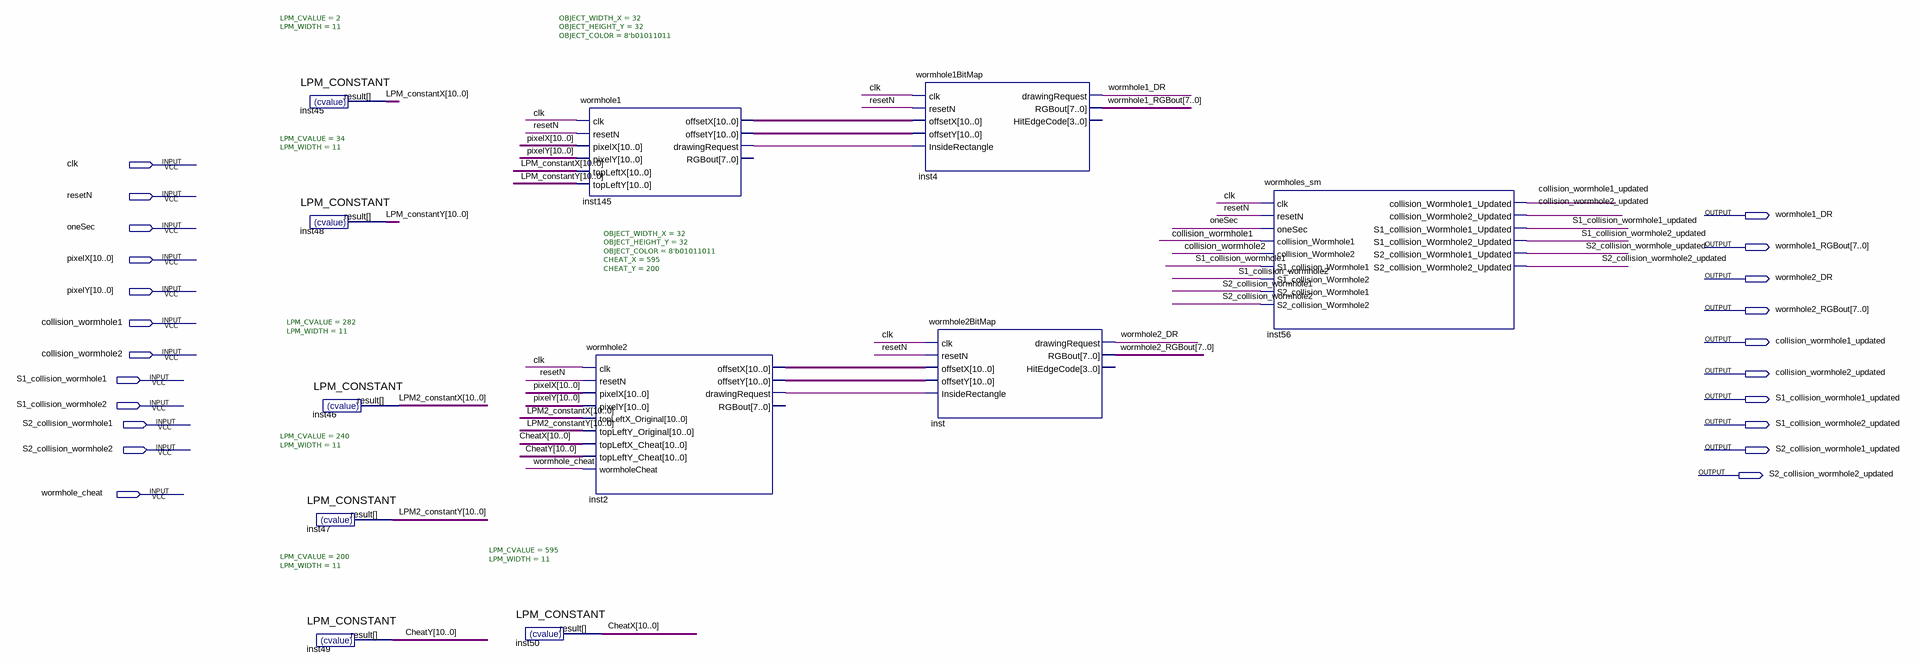
[diagram p0: schematic sheet]
// Quartus schematic wormholes.bdf as structural Verilog: 11 symbols, 22 pins
module wormholes (
  input  clk,
  input  resetN,
  input  oneSec,
  input  [10:0] pixelX,
  input  [10:0] pixelY,
  input  collision_wormhole1,
  input  collision_wormhole2,
  input  S1_collision_wormhole1,
  input  S1_collision_wormhole2,
  input  S2_collision_wormhole1,
  input  S2_collision_wormhole2,
  input  wormhole_cheat,
  output wormhole1_DR,
  output [7:0] wormhole1_RGBout,
  output wormhole2_DR,
  output [7:0] wormhole2_RGBout,
  output collision_wormhole1_updated,
  output collision_wormhole2_updated,
  output S1_collision_wormhole1_updated,
  output S1_collision_wormhole2_updated,
  output S2_collision_wormhole1_updated,
  output S2_collision_wormhole2_updated
);

  wire inst2_drawingrequest, inst145_drawingrequest, S2_collision_wormhole_updated;
  wire [10:0] CheatX, CheatY, inst2_offsetx, inst2_offsety, inst145_offsetx, inst145_offsety, LPM2_constantX,
       LPM2_constantY, LPM_constantX, LPM_constantY;

  LPM_CONSTANT #(.LPM_CVALUE(2), .LPM_WIDTH(11)) inst45 (.result(LPM_constantX));
  LPM_CONSTANT #(.LPM_CVALUE(34), .LPM_WIDTH(11)) inst48 (.result(LPM_constantY));
  LPM_CONSTANT #(.LPM_CVALUE(282), .LPM_WIDTH(11)) inst46 (.result(LPM2_constantX));
  LPM_CONSTANT #(.LPM_CVALUE(240), .LPM_WIDTH(11)) inst47 (.result(LPM2_constantY));
  LPM_CONSTANT #(.LPM_CVALUE(200), .LPM_WIDTH(11)) inst49 (.result(CheatY));
  LPM_CONSTANT #(.LPM_CVALUE(595), .LPM_WIDTH(11)) inst50 (.result(CheatX));
  wormhole1 #(.OBJECT_WIDTH_X(32), .OBJECT_HEIGHT_Y(32), .OBJECT_COLOR(8'b01011011)) inst145 (
    .clk(clk), .resetN(resetN), .pixelX(pixelX), .pixelY(pixelY), .topLeftX(LPM_constantX),
    .topLeftY(LPM_constantY), .offsetX(inst145_offsetx), .offsetY(inst145_offsety),
    .drawingRequest(inst145_drawingrequest));  // open: RGBout
  wormhole2 #(.OBJECT_WIDTH_X(32), .OBJECT_HEIGHT_Y(32), .OBJECT_COLOR(8'b01011011), .CHEAT_X(595), .CHEAT_Y(200)) inst2 (
    .clk(clk), .resetN(resetN), .pixelX(pixelX), .pixelY(pixelY), .topLeftX_Original(LPM2_constantX),
    .topLeftY_Original(LPM2_constantY), .topLeftX_Cheat(CheatX), .topLeftY_Cheat(CheatY),
    .wormholeCheat(wormhole_cheat), .offsetX(inst2_offsetx), .offsetY(inst2_offsety),
    .drawingRequest(inst2_drawingrequest));  // open: RGBout
  wormhole1BitMap inst4 (
    .clk(clk), .resetN(resetN), .offsetX(inst145_offsetx), .offsetY(inst145_offsety),
    .InsideRectangle(inst145_drawingrequest), .drawingRequest(wormhole1_DR), .RGBout(wormhole1_RGBout));  // open: HitEdgeCode
  wormhole2BitMap inst (
    .clk(clk), .resetN(resetN), .offsetX(inst2_offsetx), .offsetY(inst2_offsety),
    .InsideRectangle(inst2_drawingrequest), .drawingRequest(wormhole2_DR), .RGBout(wormhole2_RGBout));  // open: HitEdgeCode
  wormholes_sm inst56 (
    .clk(clk), .resetN(resetN), .oneSec(oneSec), .collision_Wormhole1(collision_wormhole1),
    .collision_Wormhole2(collision_wormhole2), .S1_collision_Wormhole1(S1_collision_wormhole1),
    .S1_collision_Wormhole2(S1_collision_wormhole2), .S2_collision_Wormhole1(S2_collision_wormhole1),
    .S2_collision_Wormhole2(S2_collision_wormhole2),
    .collision_Wormhole1_Updated(collision_wormhole1_updated),
    .collision_Wormhole2_Updated(collision_wormhole2_updated),
    .S1_collision_Wormhole1_Updated(S1_collision_wormhole1_updated),
    .S1_collision_Wormhole2_Updated(S1_collision_wormhole2_updated),
    .S2_collision_Wormhole1_Updated(S2_collision_wormhole_updated),
    .S2_collision_Wormhole2_Updated(S2_collision_wormhole2_updated));
endmodule
